# Altium project UART_Schnittstelle.PrjPcb
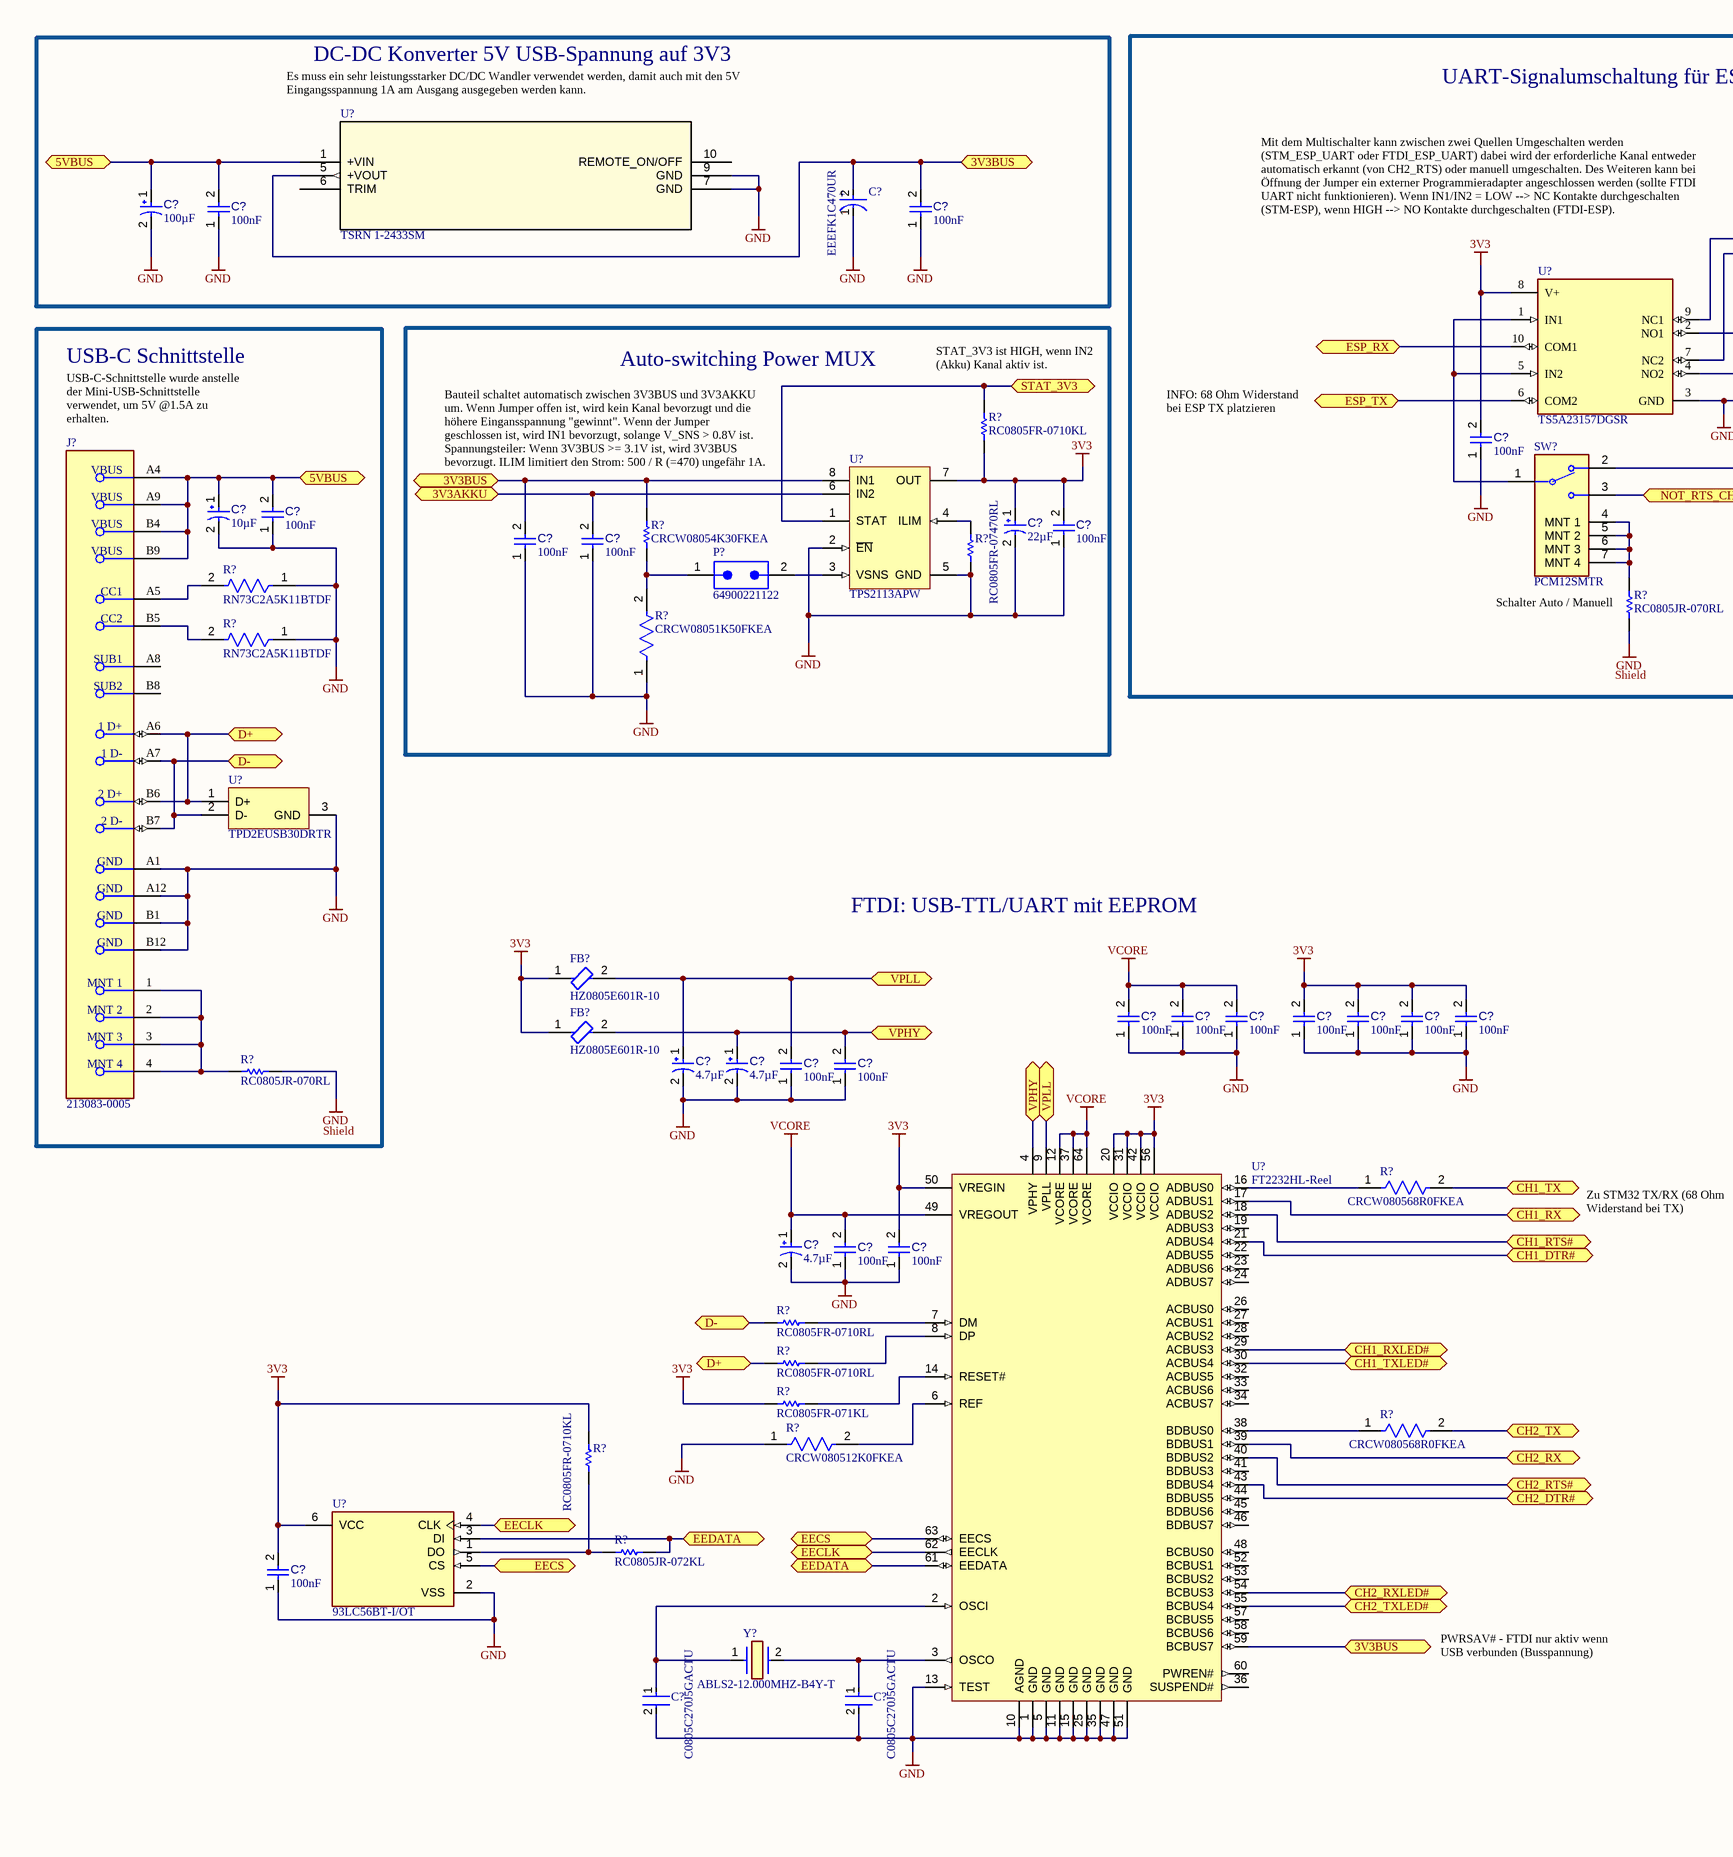
[diagram p0: PCB_USB_UART.SchDoc, left]
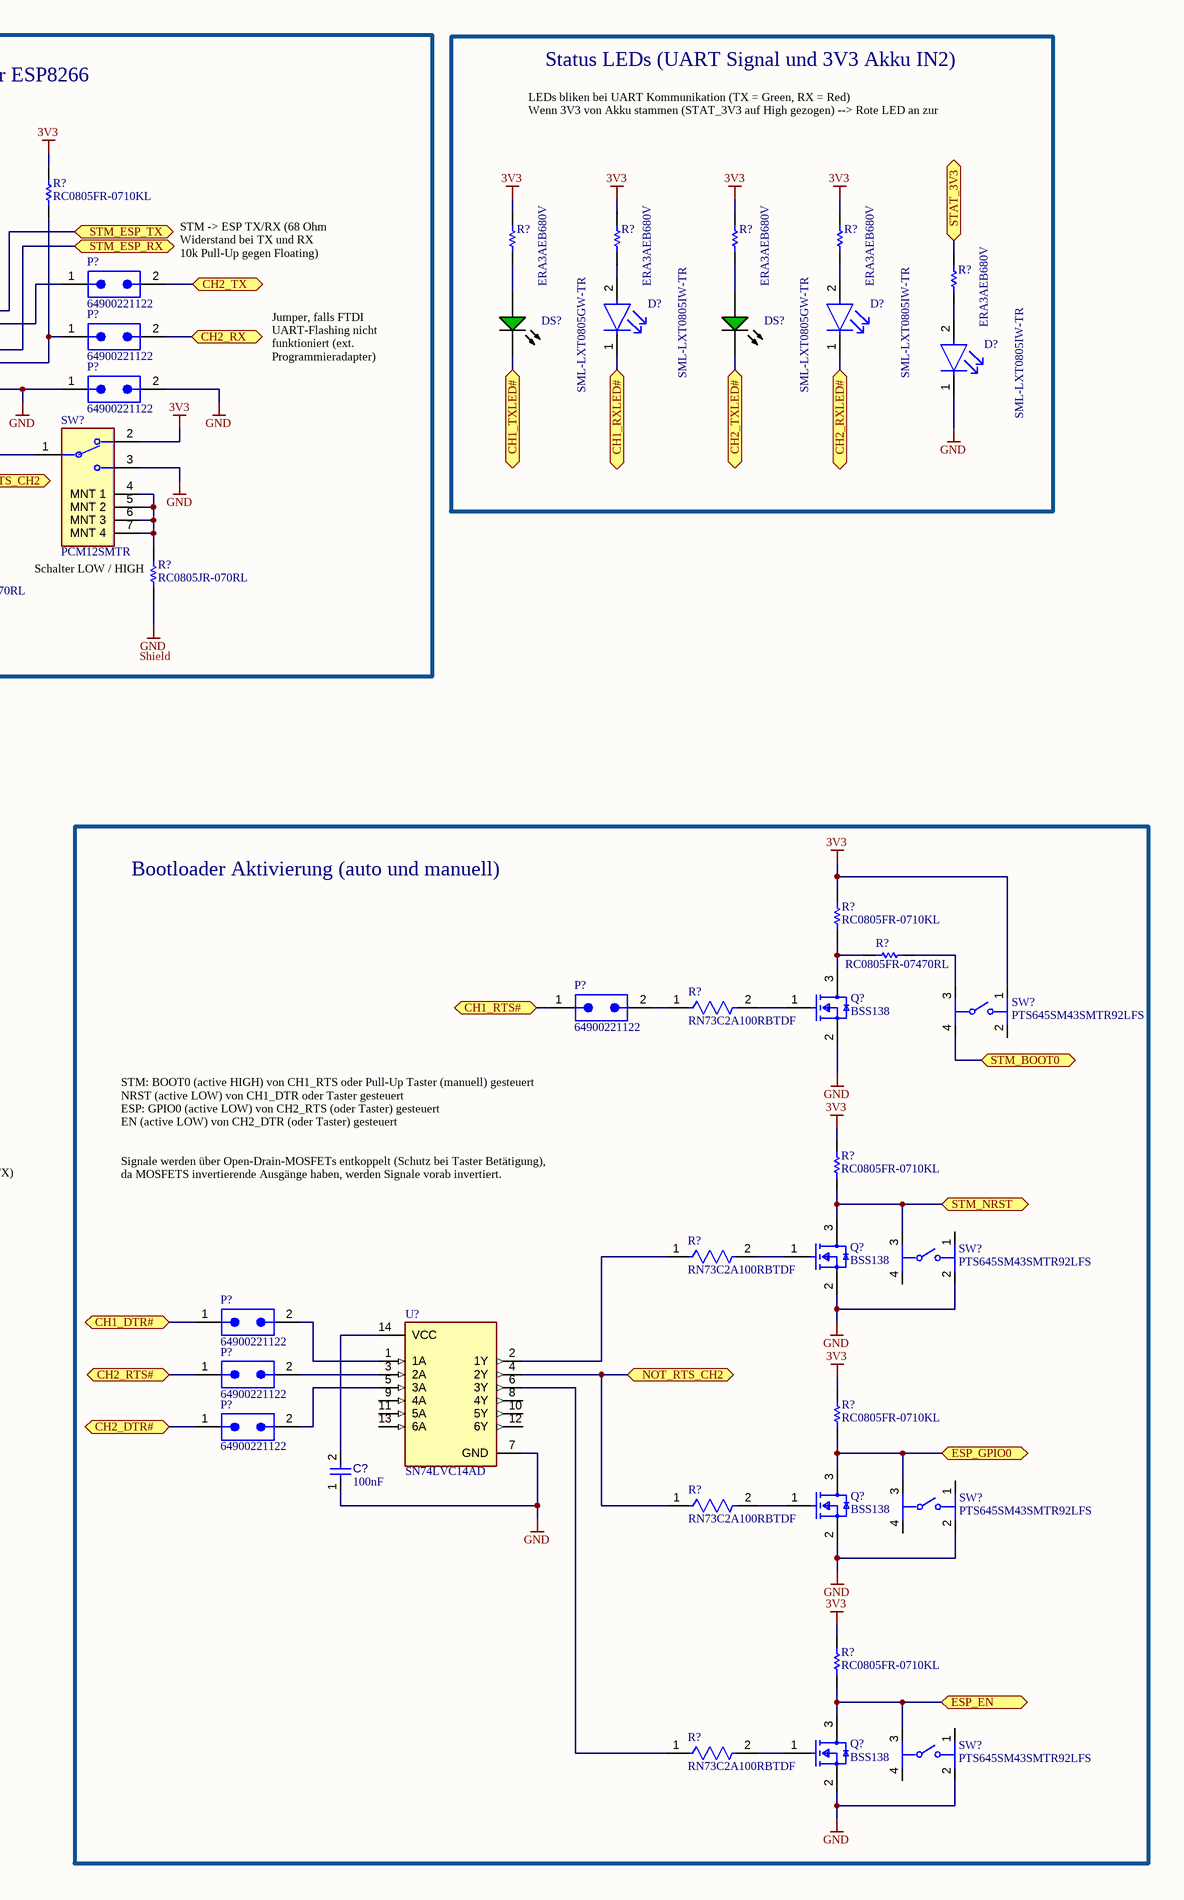
[diagram p1: PCB_USB_UART.SchDoc, right]
1 sheet, 95 parts. Net scope: flat (ports and power ports of the same name join across sheets).

## Sheet PCB_USB_UART.SchDoc
size A2; SheetNumber: 1; SheetTotal: 1

### Parts
(Parts that share a designator on the sheet are numbered #1, #2 ... from top to bottom, then left to right.)
C?#1  value 100µF  [CAPPR65-350-1150X800X1250]  (hidden comment: ECA1HM101)
C?#2  EEEFK1C470UR  [FP-FKC-MFG]
C?#3  value 100nF  [CAPC2013X95X50LL10T25]  (hidden comment: Capacitor 100 nF +/-10% 50 V 0805)
C?#4  value 100nF  [CAPC2013X95X50LL10T25]  (hidden comment: Capacitor 100 nF +/-10% 50 V 0805)
C?#5  value 100nF  [CAPC2013X95X50LL10T25]  (hidden comment: Capacitor 100 nF +/-10% 50 V 0805)
C?#6  value 10µF  [CAPPR55-200-1100X500X1200]  (hidden comment: ECA1HM100)
C?#7  value 22µF  [CAPPR55-200-1100X500X1200]  (hidden comment: ECA1HM220)
C?#8  value 100nF  [CAPC2013X95X50LL10T25]  (hidden comment: Capacitor 100 nF +/-10% 50 V 0805)
C?#9  value 100nF  [CAPC2013X95X50LL10T25]  (hidden comment: Capacitor 100 nF +/-10% 50 V 0805)
C?#10  value 100nF  [CAPC2013X95X50LL10T25]  (hidden comment: Capacitor 100 nF +/-10% 50 V 0805)
C?#11  value 100nF  [CAPC2013X95X50LL10T25]  (hidden comment: Capacitor 100 nF +/-10% 50 V 0805)
C?#12  value 100nF  [CAPC2013X95X50LL10T25]  (hidden comment: Capacitor 100 nF +/-10% 50 V 0805)
C?#13  value 100nF  [CAPC2013X95X50LL10T25]  (hidden comment: Capacitor 100 nF +/-10% 50 V 0805)
C?#14  value 100nF  [CAPC2013X95X50LL10T25]  (hidden comment: Capacitor 100 nF +/-10% 50 V 0805)
C?#15  value 100nF  [CAPC2013X95X50LL10T25]  (hidden comment: Capacitor 100 nF +/-10% 50 V 0805)
C?#16  value 100nF  [CAPC2013X95X50LL10T25]  (hidden comment: Capacitor 100 nF +/-10% 50 V 0805)
C?#17  value 100nF  [CAPC2013X95X50LL10T25]  (hidden comment: Capacitor 100 nF +/-10% 50 V 0805)
C?#18  value 100nF  [CAPC2013X95X50LL10T25]  (hidden comment: Capacitor 100 nF +/-10% 50 V 0805)
C?#19  value 4.7µF  [CAPPR55-200-1100X500X1200]  (hidden comment: ECA1HM4R7)
C?#20  value 4.7µF  [CAPPR55-200-1100X500X1200]  (hidden comment: ECA1HM4R7)
C?#21  value 100nF  [CAPC2013X95X50LL10T25]  (hidden comment: Capacitor 100 nF +/-10% 50 V 0805)
C?#22  value 100nF  [CAPC2013X95X50LL10T25]  (hidden comment: Capacitor 100 nF +/-10% 50 V 0805)
C?#23  value 4.7µF  [CAPPR55-200-1100X500X1200]  (hidden comment: ECA1HM4R7)
C?#24  value 100nF  [CAPC2013X95X50LL10T25]  (hidden comment: Capacitor 100 nF +/-10% 50 V 0805)
C?#25  value 100nF  [CAPC2013X95X50LL10T25]  (hidden comment: Capacitor 100 nF +/-10% 50 V 0805)
C?#26  value 100nF  [CAPC2013X95X50LL10T25]  (hidden comment: Capacitor 100 nF +/-10% 50 V 0805)
C?#27  value 100nF  [CAPC2013X95X50LL10T25]  (hidden comment: Capacitor 100 nF +/-10% 50 V 0805)
C?#28  C0805C270J5GACTU  [FP-C0805C-DN-MFG]
C?#29  C0805C270J5GACTU  [FP-C0805C-DN-MFG]
D?#1  SML-LXT0805IW-TR  [FP-SML-LXT0805IW-TR-MFG]
D?#2  SML-LXT0805IW-TR  [FP-SML-LXT0805IW-TR-MFG]
D?#3  SML-LXT0805IW-TR  [FP-SML-LXT0805IW-TR-MFG]
DS?#1  SML-LXT0805GW-TR  [LUMX-SML-LXT0805_V]
DS?#2  SML-LXT0805GW-TR  [LUMX-SML-LXT0805_V]
FB?#1  HZ0805E601R-10  [FP-HZ0805-MFG]
FB?#2  HZ0805E601R-10  [FP-HZ0805-MFG]
J?  213083-0005  [FP-2130830005-MFG]
P?#1  64900221122  [64900221122]
P?#2  64900221122  [64900221122]
P?#3  64900221122  [64900221122]
P?#4  64900221122  [64900221122]
P?#5  64900221122  [64900221122]
P?#6  64900221122  [64900221122]
P?#7  64900221122  [64900221122]
P?#8  64900221122  [64900221122]
Q?#1  BSS138  [FP-318-08-IPC_B]
Q?#2  BSS138  [FP-318-08-IPC_B]
Q?#3  BSS138  [FP-318-08-IPC_B]
Q?#4  BSS138  [FP-318-08-IPC_B]
R?#1  RC0805FR-0710KL  [RESC2013X60X35NL10T20]
R?#2  ERA3AEB680V  [RESC1608X55X30LL20T20]
R?#3  ERA3AEB680V  [RESC1608X55X30LL20T20]
R?#4  ERA3AEB680V  [RESC1608X55X30LL20T20]
R?#5  ERA3AEB680V  [RESC1608X55X30LL20T20]
R?#6  ERA3AEB680V  [RESC1608X55X30LL20T20]
R?#7  RC0805FR-0710KL  [RESC2013X60X35NL10T20]
R?#8  CRCW08054K30FKEA  [RESC2013X50X30LL20T20]
R?#9  RC0805FR-07470RL  [RESC2013X60X35LL10T20]
R?#10  RN73C2A5K11BTDF  [FP-RN732A-MFG]
R?#11  RC0805JR-070RL  [RESC2013X60X35ML10T20]
R?#12  RC0805JR-070RL  [RESC2013X60X35ML10T20]
R?#13  RN73C2A5K11BTDF  [FP-RN732A-MFG]
R?#14  CRCW08051K50FKEA  [FP-CRCW0805-e3-MFG]
R?#15  RC0805FR-0710KL  [RESC2013X60X35NL10T20]
R?#16  RC0805FR-07470RL  [RESC2013X60X35LL10T20]
R?#17  RN73C2A100RBTDF  [FP-RN732A-MFG]
R?#18  RC0805JR-070RL  [RESC2013X60X35ML10T20]
R?#19  CRCW080568R0FKEA  [FP-CRCW0805-e3-IPC_C]
R?#20  RC0805FR-0710KL  [RESC2013X60X35NL10T20]
R?#21  RN73C2A100RBTDF  [FP-RN732A-MFG]
R?#22  RC0805FR-0710RL  [RESC2013X60X35ML10T20]
R?#23  RC0805FR-0710RL  [RESC2013X60X35ML10T20]
R?#24  RC0805FR-071KL  [RESC2013X60X35ML10T20]
R?#25  CRCW080568R0FKEA  [FP-CRCW0805-e3-IPC_C]
R?#26  CRCW080512K0FKEA  [FP-CRCW0805-e3-IPC_A]
R?#27  RC0805FR-0710KL  [RESC2013X60X35NL10T20]
R?#28  RC0805FR-0710KL  [RESC2013X60X35NL10T20]
R?#29  RC0805JR-072KL  [RESC2013X60X35ML10T20]
R?#30  RN73C2A100RBTDF  [FP-RN732A-MFG]
R?#31  RC0805FR-0710KL  [RESC2013X60X35NL10T20]
R?#32  RN73C2A100RBTDF  [FP-RN732A-MFG]
SW?#1  PCM12SMTR  [FP-PCM12SMTR-MFG]
SW?#2  PCM12SMTR  [FP-PCM12SMTR-MFG]
SW?#3  PTS645SM43SMTR92LFS  [FP-PTS645SM43SMTR92LFS-MFG]
SW?#4  PTS645SM43SMTR92LFS  [FP-PTS645SM43SMTR92LFS-MFG]
SW?#5  PTS645SM43SMTR92LFS  [FP-PTS645SM43SMTR92LFS-MFG]
SW?#6  PTS645SM43SMTR92LFS  [FP-PTS645SM43SMTR92LFS-MFG]
U?#1  TSRN 1-2433SM  [TSR(N]
U?#2  TS5A23157DGSR  [FP-DGS0010A-IPC_C]
U?#3  TPS2113APW  [PW0008A_N]
U?#4  TPD2EUSB30DRTR  [DRT0003A]
U?#5  FT2232HL-Reel  [LQFP-64_M]
U?#6  SN74LVC14AD  [FP-D0014A-MFG]
U?#7  93LC56BT-I/OT  [FP-C04-028-MFG]
Y?  ABLS2-12.000MHZ-B4Y-T  [ABLS]

### Blocks framed on the sheet
DC-DC Konverter 5V USB-Spannung auf 3V3: C?#1-C?#4 U?#1
UART-Signalumschaltung für ESP8266: C?#5 P?#1-P?#3 R?#1 R?#11 R?#12 SW?#1 SW?#2 U?#2
Status LEDs (UART Signal und 3V3 Akku IN2): D?#1-D?#3 DS?#1 DS?#2 R?#2-R?#6
USB-C Schnittstelle: C?#6 C?#8 J? R?#10 R?#13 R?#18 U?#4
Auto-switching Power MUX: C?#7 C?#9-C?#11 P?#4 R?#7-R?#9 R?#14 U?#3
Bootloader Aktivierung (auto und manuell): C?#26 P?#5-P?#8 Q?#1-Q?#4 R?#15-R?#17 R?#20 R?#21 R?#28 R?#30-R?#32 SW?#3-SW?#6 U?#6

### Ports
3V3AKKU (bidir), 3V3BUS (bidir, see PCB_USB_UART[2B], PCB_USB_UART[3A]), 3V3BUS (bidir, see PCB_USB_UART[2B], PCB_USB_UART[4D]), 3V3BUS (bidir, see PCB_USB_UART[3A], PCB_USB_UART[4D]), 5VBUS (bidir, see PCB_USB_UART[1A]), 5VBUS (bidir, see PCB_USB_UART[1B]), CH1_DTR# (bidir, see PCB_USB_UART[5C]), CH1_RTS# (bidir, see PCB_USB_UART[5C]), CH1_RTS# (bidir, see PCB_USB_UART[6C]), CH1_RX (bidir), CH1_RXLED# (bidir, see PCB_USB_UART[4C]), CH1_RXLED# (bidir, see PCB_USB_UART[7B]), CH1_TX (bidir), CH1_TXLED# (bidir, see PCB_USB_UART[4C]), CH1_TXLED# (bidir, see PCB_USB_UART[6B]), CH2_DTR# (bidir, see PCB_USB_UART[5C]), CH2_RTS# (bidir, see PCB_USB_UART[5C]), CH2_RX (bidir, see PCB_USB_UART[5C]), CH2_RX (bidir, see PCB_USB_UART[6A]), CH2_RXLED# (bidir, see PCB_USB_UART[4D]), CH2_RXLED# (bidir, see PCB_USB_UART[7B]), CH2_TX (bidir, see PCB_USB_UART[5C]), CH2_TX (bidir, see PCB_USB_UART[6A]), CH2_TXLED# (bidir, see PCB_USB_UART[4D]), CH2_TXLED# (bidir, see PCB_USB_UART[7B]), D+ (bidir, see PCB_USB_UART[1B]), D+ (bidir, see PCB_USB_UART[2C]), D- (bidir, see PCB_USB_UART[1B]), D- (bidir, see PCB_USB_UART[2C]), EECLK (bidir, see PCB_USB_UART[2D]), EECLK (bidir, see PCB_USB_UART[3D]), EECS (bidir, see PCB_USB_UART[2D]), EECS (bidir, see PCB_USB_UART[3D]), EEDATA (bidir, see PCB_USB_UART[2D]), EEDATA (bidir, see PCB_USB_UART[3D]), ESP_EN (bidir), ESP_GPIO0 (bidir), ESP_RX (bidir), ESP_TX (bidir), NOT_RTS_CH2 (bidir, see PCB_USB_UART[5B]), NOT_RTS_CH2 (bidir, see PCB_USB_UART[7C]), STAT_3V3 (bidir, see PCB_USB_UART[3A]), STAT_3V3 (bidir, see PCB_USB_UART[8A]), STM_BOOT0 (bidir), STM_ESP_RX (bidir), STM_ESP_TX (bidir), STM_NRST (bidir), VPHY (bidir, see PCB_USB_UART[3C]), VPLL (bidir, see PCB_USB_UART[3B]), VPLL (bidir, see PCB_USB_UART[3C])

### Nets
3V3: C?#5.2 C?#7.1 C?#9.2 C?#15.2 C?#16.2 C?#17.2 C?#18.2 C?#25.2 C?#27.2 FB?#1.1 FB?#2.1 R?#1.2 R?#2.2 R?#3.2 R?#4.2 R?#5.2 R?#7.1 R?#15.2 R?#20.2 R?#24.1 R?#27.2 R?#28.2 R?#31.2 SW?#1.2 SW?#3.1 U?#2.8(V+) U?#3.7(OUT) U?#5.20(VCCIO) U?#5.31(VCCIO) U?#5.42(VCCIO) U?#5.50(VREGIN) U?#5.56(VCCIO) U?#7.6(VCC)
GND: C?#1.2 C?#2.1(C) C?#3.1 C?#4.1 C?#5.1 C?#6.2 C?#7.2 C?#8.1 C?#9.1 C?#10.1 C?#11.1 C?#12.1 C?#13.1 C?#14.1 C?#15.1 C?#16.1 C?#17.1 C?#18.1 C?#19.2 C?#20.2 C?#21.1 C?#22.1 C?#23.2 C?#24.1 C?#25.1 C?#26.1 C?#27.1 C?#28.2 C?#29.2 D?#3.1(C) J?.A1(GND) J?.A12(GND) J?.B1(GND) J?.B12(GND) P?#3.1 P?#3.2 Q?#1.2(S) Q?#2.2(S) Q?#3.2(S) Q?#4.2(S) R?#9.1 R?#10.1 R?#11.1 R?#12.1 R?#13.1 R?#14.1 R?#18.2 R?#26.1 SW?#1.3 SW?#4.2 SW?#5.2 SW?#6.2 U?#1.7(GND) U?#1.9(GND) U?#2.3(GND) U?#3.2(~{EN}) U?#3.5(GND) U?#4.3(GND) U?#5.1(GND) U?#5.5(GND) U?#5.10(AGND) U?#5.11(GND) U?#5.13(TEST) U?#5.15(GND) U?#5.25(GND) U?#5.35(GND) U?#5.47(GND) U?#5.51(GND) U?#6.7(GND) U?#7.2(VSS)
VCORE: C?#12.2 C?#13.2 C?#14.2 C?#23.1 C?#24.2 U?#5.12(VCORE) U?#5.37(VCORE) U?#5.49(VREGOUT) U?#5.64(VCORE)
NetC?#1_1: C?#1.1 C?#3.2 C?#6.1 C?#8.2 J?.A4(VBUS) J?.A9(VBUS) J?.B4(VBUS) J?.B9(VBUS) U?#1.1(+VIN) ; port 5VBUS
NetC?#2_2: C?#2.2(A) C?#4.2 C?#10.2 R?#8.2 U?#1.5(+VOUT) U?#3.8(IN1) U?#5.59(BCBUS7) ; port 3V3BUS
NetC?#11_2: C?#11.2 U?#3.6(IN2) ; port 3V3AKKU
NetC?#19_1: C?#19.1 C?#21.2 FB?#1.2 U?#5.9(VPLL) ; port VPLL
NetC?#20_1: C?#20.1 C?#22.2 FB?#2.2 U?#5.4(VPHY) ; port VPHY
NetC?#26_2: C?#26.2 U?#6.14(VCC)
NetC?#28_1: C?#28.1 U?#5.2(OSCI) Y?.1
NetC?#29_1: C?#29.1 U?#5.3(OSCO) Y?.2
NetD?#1_1: D?#1.1(C) U?#5.29(ACBUS3) ; port CH1_RXLED#
NetD?#1_2: D?#1.2(A) R?#3.1
NetD?#2_1: D?#2.1(C) U?#5.54(BCBUS3) ; port CH2_RXLED#
NetD?#2_2: D?#2.2(A) R?#5.1
NetD?#3_2: D?#3.2(A) R?#6.1
NetDS?#1_1: DS?#1.1(A) R?#2.1
NetDS?#1_2: DS?#1.2(K) U?#5.30(ACBUS4) ; port CH1_TXLED#
NetDS?#2_1: DS?#2.1(A) R?#4.1
NetDS?#2_2: DS?#2.2(K) U?#5.55(BCBUS4) ; port CH2_TXLED#
NetJ?_1: J?.1(MNT_1) J?.2(MNT_2) J?.3(MNT_3) J?.4(MNT_4) R?#18.1
NetJ?_A5: J?.A5(CC1) R?#10.2
NetJ?_A6: J?.A6(1_D+) J?.B6(2_D+) R?#23.1 U?#4.1(D+) ; port D+
NetJ?_A7: J?.A7(1_D-) J?.B7(2_D-) R?#22.1 U?#4.2(D-) ; port D-
NetJ?_B5: J?.B5(CC2) R?#13.2
NetP?#1_1: P?#1.1 U?#2.2(NO1)
NetP?#1_2: P?#1.2 R?#25.2 ; port CH2_TX
NetP?#2_1: P?#2.1 R?#1.1 U?#2.4(NO2)
NetP?#2_2: P?#2.2 U?#5.39(BDBUS1) ; port CH2_RX
NetP?#4_1: P?#4.1 R?#8.1 R?#14.2
NetP?#4_2: P?#4.2 U?#3.3(VSNS)
NetP?#5_1: P?#5.1 U?#5.18(ADBUS2) ; port CH1_RTS#
NetP?#5_2: P?#5.2 R?#17.1
NetP?#6_1: P?#6.1 U?#5.21(ADBUS4) ; port CH1_DTR#
NetP?#6_2: P?#6.2 U?#6.1(1A)
NetP?#7_1: P?#7.1 U?#5.40(BDBUS2) ; port CH2_RTS#
NetP?#7_2: P?#7.2 U?#6.3(2A)
NetP?#8_1: P?#8.1 U?#5.43(BDBUS4) ; port CH2_DTR#
NetP?#8_2: P?#8.2 U?#6.5(3A)
NetQ?#1_1: Q?#1.1(G) R?#17.2
NetQ?#1_3: Q?#1.3(D) R?#15.1 R?#16.1
NetQ?#2_1: Q?#2.1(G) R?#21.2
NetQ?#2_3: Q?#2.3(D) R?#20.1 SW?#4.3 ; port STM_NRST
NetQ?#3_1: Q?#3.1(G) R?#30.2
NetQ?#3_3: Q?#3.3(D) R?#28.1 SW?#5.3 ; port ESP_GPIO0
NetQ?#4_1: Q?#4.1(G) R?#32.2
NetQ?#4_3: Q?#4.3(D) R?#31.1 SW?#6.3 ; port ESP_EN
NetR?#6_2: R?#6.2 R?#7.2 U?#3.1(STAT) ; port STAT_3V3
NetR?#9_2: R?#9.2 U?#3.4(ILIM)
NetR?#11_2: R?#11.2 SW?#1.4(MNT_1) SW?#1.5(MNT_2) SW?#1.6(MNT_3) SW?#1.7(MNT_4)
NetR?#12_2: R?#12.2 SW?#2.4(MNT_1) SW?#2.5(MNT_2) SW?#2.6(MNT_3) SW?#2.7(MNT_4)
NetR?#16_2: R?#16.2 SW?#3.3
NetR?#19_1: R?#19.1 U?#5.16(ADBUS0)
NetR?#19_2: R?#19.2 ; port CH1_TX
NetR?#21_1: R?#21.1 U?#6.2(1Y)
NetR?#22_2: R?#22.2 U?#5.7(DM)
NetR?#23_2: R?#23.2 U?#5.8(DP)
NetR?#24_2: R?#24.2 U?#5.14(RESET#)
NetR?#25_1: R?#25.1 U?#5.38(BDBUS0)
NetR?#26_2: R?#26.2 U?#5.6(REF)
NetR?#27_1: R?#27.1 R?#29.1 U?#7.1(DO)
NetR?#29_2: R?#29.2 U?#5.61(EEDATA) U?#7.3(DI) ; port EEDATA
NetR?#30_1: R?#30.1 SW?#2.3 U?#6.4(2Y) ; port NOT_RTS_CH2
NetR?#32_1: R?#32.1 U?#6.6(3Y)
NetSW?#1_1: SW?#1.1 SW?#2.2
NetSW?#2_1: SW?#2.1 U?#2.1(IN1) U?#2.5(IN2)
NetSW?#3_4: SW?#3.4 ; port STM_BOOT0
NetU?#2_6: U?#2.6(COM2) ; port ESP_TX
NetU?#2_7: U?#2.7(NC2) ; port STM_ESP_RX
NetU?#2_9: U?#2.9(NC1) ; port STM_ESP_TX
NetU?#2_10: U?#2.10(COM1) ; port ESP_RX
NetU?#5_17: U?#5.17(ADBUS1) ; port CH1_RX
NetU?#5_62: U?#5.62(EECLK) U?#7.4(CLK) ; port EECLK
NetU?#5_63: U?#5.63(EECS) U?#7.5(CS) ; port EECS

Not connected (* = marked no-connect by the designer): J? A8(SUB1) B8(SUB2); SW?#3 2; SW?#4 1 4; SW?#5 1 4; SW?#6 1 4; U?#1 6(TRIM) 10(REMOTE_ON/OFF); U?#5 19(ADBUS3) 22(ADBUS5) 23(ADBUS6) 24(ADBUS7) 26(ACBUS0) 27(ACBUS1) 28(ACBUS2) 32(ACBUS5) 33(ACBUS6) 34(ACBUS7) 36(SUSPEND#) 41(BDBUS3) 44(BDBUS5) 45(BDBUS6) 46(BDBUS7) 48(BCBUS0) 52(BCBUS1) 53(BCBUS2) 57(BCBUS5) 58(BCBUS6) 60(PWREN#); U?#6 8(4Y) 9(4A) 10(5Y) 11(5A) 12(6Y) 13(6A)

### Notes on the sheet
- Es muss ein sehr leistungsstarker DC/DC Wandler verwendet werden, damit auch mit den 5V Eingangsspannung 1A am Ausgang ausgegeben werden kann.
- LEDs bliken bei UART Kommunikation (TX = Green, RX = Red)
  Wenn 3V3 von Akku stammen (STAT_3V3 auf High gezogen) --> Rote LED an zur Statusanzeige
- (near R?#1) Mit dem Multischalter kann zwischen zwei Quellen Umgeschalten werden (STM_ESP_UART oder FTDI_ESP_UART) dabei wird der erforderliche Kanal entweder automatisch erkannt (von CH2_RTS) oder manuell umgeschalten. Des Weiteren kann bei Öffnung der Jumper ein externer Programmieradapter angeschlossen werden (sollte FTDI UART nicht funktionieren). Wenn IN1/IN2 = LOW --> NC Kontakte durchgeschalten (STM-ESP), wenn HIGH --> NO Kontakte durchgeschalten (FTDI-ESP).
- (near P?#1) STM -> ESP TX/RX (68 Ohm Widerstand bei TX und RX 10k Pull-Up gegen Floating)
- (near R?#7) STAT_3V3 ist HIGH, wenn IN2 (Akku) Kanal aktiv ist.
- Jumper, falls FTDI UART-Flashing nicht funktioniert (ext. Programmieradapter)
- USB-C-Schnittstelle wurde anstelle der Mini-USB-Schnittstelle verwendet, um 5V @1.5A zu erhalten.
- INFO: 68 Ohm Widerstand bei ESP TX platzieren
- Bauteil schaltet automatisch zwischen 3V3BUS und 3V3AKKU um. Wenn Jumper offen ist, wird kein Kanal bevorzugt und die höhere Eingansspannung "gewinnt". Wenn der Jumper geschlossen ist, wird IN1 bevorzugt, solange V_SNS > 0.8V ist. Spannungsteiler: Wenn 3V3BUS >= 3.1V ist, wird 3V3BUS bevorzugt. ILIM limitiert den Strom: 500 / R (=470) ungefähr 1A.
- (near R?#11) Schalter LOW / HIGH
- (near R?#12) Schalter Auto / Manuell
- (near R?#12) Shield
- Shield
- FTDI: USB-TTL/UART mit EEPROM
- Zu STM32 TX/RX (68 Ohm Widerstand bei TX)
- STM: BOOT0 (active HIGH) von CH1_RTS oder Pull-Up Taster (manuell) gesteuert
  NRST (active LOW) von CH1_DTR oder Taster gesteuert
  ESP: GPIO0 (active LOW) von CH2_RTS (oder Taster) gesteuert
  EN (active LOW) von CH2_DTR (oder Taster) gesteuert
  Signale werden über Open-Drain-MOSFETs entkoppelt (Schutz bei Taster Betätigung), da MOSFETS invertierende Ausgänge haben, werden Signale vorab invertiert.
- PWRSAV# - FTDI nur aktiv wenn USB verbunden (Busspannung)
- DWG NO:
- REV:
- THIS DOCUMENT AND THE DATA DISCLOSED HEREIN OR
- HEREWITH IS THE PROPERTY OF ALTIUM LIMITED AND MAY
- BE FREELY DISTRIBUTED IN WHOLE. NO RIGHTS ARE
- RESERVED OR EXPRESS OR IMPLIED WARANTEE GIVEN.
- REVISION
- DESCRIPTION
- DATE
- APPROVED
- ENG:
- APPROVALS
- PROJECT
- DSN:
- CHK:
- REFERENCE DOCUMENTS
- PROJECT REVISION:
- TITLE
- DOCUMENT REVISION:
- DESIGN ITEM:
- BOM:
- FAB DWG:
- PCB DWG:
- ASSY DWG:
- SCALE:
- A2
- SIZE
- CAGE CODE
- FILE NAME
- DWG NO.
- SHEET
- OF
- REV
- (in symbol CMP-05427-002132-1) +

### Library data of the parts
C?#1 = CMP-001-00026-7: Aluminum Electrolytic Capacitor, 100 uF, +/- 20%, 50 V, -40 to 85 degC, 2-Pin THD, RoHS, Bulk; Manufacturer: Panasonic; Voltage Rating: 50V; Ripple Current: 250mA; Datasheet URL: https://industrial.panasonic.com/cdbs/www-data/pdf/RDF0000/ABA0000C1218.pdf; Lead Pitch: 3.5mm; Mounting Technology: TH; Package Description: 2-Pin Radial Lead, Dia 8 mm, Height 12.5 mm; Diameter: 8mm; Ripple Current (AC): 250mA; Manufacturer URL: http://www.panasonic.com/; Capacitor Type: Electrolytic; Max Operating Temperature: 85°C; Pins: 2; Min Operating Temperature: -40°C; Tolerance: 20%; Case/Package: Radial; Packaging: Bulk; Package Quantity: 200; Package Reference: CAPPR65-350-1150X800X1250; RoHS Compliant: True; Datasheet Version: Rev. 05, 10/2016
C?#2 = CMP-05427-002132-1: CAP ALUM 47UF 20% 16V SMD; Dielectric Material: Aluminium; ESR (Equivalent Series Resistance): 700mR; Ripple Current: 160mA; Life (Hours): 2000Hour; Leakage Current: 3uA; Voltage: 10V; Length: 5.8mm; Voltage Rating: 16V; Ratings: AEC-Q200; Package Quantity: 1000; Min Operating Temperature: -55°C; Mount: Surface Mount; Width: 6.5mm; Voltage Rating (DC): 16V; Radiation Hardening: No; Diameter: 5mm; RoHS Compliant: Yes; Reach SVHC Compliant: Yes; Termination: SMD/SMT; Material: Aluminium; Ripple Current (AC): 160mA; Impedance: 700mR; Series: FK; Height - Seated (Max): 0.228inch; Packaging: Tape and Reel; Height: 5.8mm; Capacitance: 47uF; Contact Plating: Tin; Construction: Cylindrical; Number of Pins: 2; Lead Free: Lead Free; Tolerance: 20%; Max Operating Temperature: 105°C; Case/Package: Radial
C?#3-C?#5 C?#8-C?#18 C?#21 C?#22 C?#24-C?#27 = CMP-001-00018-6: Chip Capacitor, 100 nF, +/- 10%, 50 V, 0805 (2012 Metric); Capacitor Type: Ceramic; Voltage Rating: 50V; Pins: 2; Max Operating Temperature: 125°C; Min Operating Temperature: -55°C; Mounting Technology: SM; Case/Package: 0805; RoHS Compliant: True; Tolerance: 10%
C?#6 = CMP-001-00025-7: Aluminum Electrolytic Capacitor, 10 uF, +/- 20%, 50 V, -40 to 85 degC, 2-Pin THD, RoHS, Bulk; Manufacturer: Panasonic; Ripple Current (AC): 65mA; Voltage Rating: 50V; Mounting Technology: TH; RoHS Compliant: True; Capacitor Type: Electrolytic; Datasheet Version: Rev. 05, 10/2016; Min Operating Temperature: -40°C; Packaging: Bulk; Ripple Current: 65mA; Tolerance: 20%; Max Operating Temperature: 85°C; Datasheet URL: https://industrial.panasonic.com/cdbs/www-data/pdf/RDF0000/ABA0000C1218.pdf; Lead Pitch: 2mm; Pins: 2; Diameter: 5mm; Manufacturer URL: http://www.panasonic.com/; Package Reference: CAPPR55-200-1100X500X1200; Package Description: 2-Pin Radial Lead, Dia 5 mm, Height 12 mm; Case/Package: Radial; Package Quantity: 200
C?#7 = CMP-001-00027-7: Aluminum Electrolytic Capacitor, 22 uF, +/- 20%, 50 V, -40 to 85 degC, 2-Pin THD, RoHS, Bulk; Manufacturer: Panasonic; Ripple Current (AC): 100mA; Voltage Rating: 50V; Pins: 2; Case/Package: Radial; Datasheet Version: Rev. 05, 10/2016; RoHS Compliant: True; Max Operating Temperature: 85°C; Ripple Current: 100mA; Capacitor Type: Electrolytic; Mounting Technology: TH; Package Quantity: 200; Package Reference: CAPPR55-200-1100X500X1200; Package Description: 2-Pin Radial Lead, Dia 5 mm, Height 12 mm; Packaging: Bulk; Lead Pitch: 2mm; Min Operating Temperature: -40°C; Diameter: 5mm; Tolerance: 20%; Datasheet URL: https://industrial.panasonic.com/cdbs/www-data/pdf/RDF0000/ABA0000C1218.pdf; Manufacturer URL: http://www.panasonic.com/
C?#19 C?#20 C?#23 = CMP-001-00033-7: Aluminum Electrolytic Capacitor, 4.7 uF, +/- 20%, 50 V, -40 to 85 degC, 2-Pin THD, RoHS, Bulk; Manufacturer: Panasonic; Ripple Current (AC): 45mA; Voltage Rating: 50V; Diameter: 5mm; Min Operating Temperature: -40°C; Lead Pitch: 2mm; Package Quantity: 200; Capacitor Type: Electrolytic; Ripple Current: 45mA; Datasheet Version: Rev. 05, 10/2016; Case/Package: Radial; Pins: 2; Manufacturer URL: http://www.panasonic.com/; RoHS Compliant: True; Package Description: 2-Pin Radial Lead, Dia 5 mm, Height 12 mm; Packaging: Bulk; Datasheet URL: https://industrial.panasonic.com/cdbs/www-data/pdf/RDF0000/ABA0000C1218.pdf; Mounting Technology: TH; Max Operating Temperature: 85°C; Package Reference: CAPPR55-200-1100X500X1200; Tolerance: 20%
C?#28 C?#29 = CMP-2007-00597-2: CAP CER 27PF 50V C0G/NP0 0805; Manufacturer: KEMET; Temperature Coefficient: 30ppm/°C; Tolerance: 0.05; Temperature Characteristic: C0G; Material: Ceramic; Device Class L3: Ceramic Capacitors; Voltage Rating: 50 V; Package: C0805C-DN; Height: 0.88mm; Temperature: -55°C to +125°C; Category: Cap; ComponentLink2URL: https://content.kemet.com/datasheets/KEM_C1003_C0G_SMD.pdf; Octopart: https://octopart.com/c0805c270j5gactu-kemet-91046; Mouser Description: Cap Ceramic 27pF 50V C0G 5% SMD 0805 125C Plastic T/R; Temperature Range High: +125°C; RoHS: TRUE; Lead Free: Yes; ComponentLink2Description: Datasheet; Temperature Range Low: -55°C; Digikey Description: CAP CER 27PF 50V C0G/NP0 0805; Manufacturer Part Number: C0805C270J5GACTU; Ipc Land Pattern Name: CAPC200125X78; Automotive: No; Device Class L1: Passive Components; Value: 27 pF; Device Class L2: Capacitors; Capacitance: 27 pF
D?#1-D?#3 = CMP-1724-00002-2: LED RED DIFFUSED SMD; Lens Style: Rectangular; Luminous Intensity: 11mcd; Approvals: UL; Test Current: 20mA; Forward Voltage: 2V; Number of LEDs: 1; Wavelength: 635nm; Lens Color: White; Viewing Angle: 140°; Min Operating Temperature: -25°C; Case Code (Metric): 2012; Mount: Surface Mount; Case Code (Imperial): 0805; Height: 0.8mm; Lead Free: Lead Free; Color: Red; Package Quantity: 1; Illumination Color: Red; Lens Transparency: Diffused; Forward Current: 20mA; Packaging: Tape and Reel; Length: 2mm; Case/Package: 0805; REACH SVHC: No SVHC; Width: 1.25mm; Number of Pins: 2; Max Operating Temperature: 80°C; Dominant Wavelength: 635nm
DS?#1 DS?#2 = CMP-1724-00001-1: LED, GREEN, 565 nm, 2 V, -25 to 80 degC, 2-Pin SMD, RoHS, Tape and Reel; Case\/Package: 0805; RoHSCompliant: true; REACH SVHC: No SVHC; Packaging: Tape and Reel; ComponentLink2URL: http://www.lumex.com/content/files/ProductAttachment/SML-LXT0805GW-TR.pdf; ComponentLink1URL: http://www.lumexinstruments.com/; Min Operating Temperature: -25 degC; Max Operating Temperature: 85 degC; DatasheetVersion: Rev. F, 09/2009; Case Code (Metric): 2012; Width: 1.25 mm; PackageDescription: 2-Pin Surface Mount Device, Body 2 x 1.25 mm; ComponentLink1Description: Manufacturer URL; Mount: Surface Mount; PackageReference: SML-LXT0805; Length: 2 mm; Case Code (Imperial): 0805; ComponentLink2Description: Datasheet; Package Quantity: 4000; Mounting Technology: Surface Mount
FB?#1 FB?#2 = CMP-2000-05194-2: FERRITE BEAD 600 OHM 0805 1LN; Current Rating: 500mA; Frequency: 100MHz; DC Resistance (DCR): 300mR; Number of Lines: 1; Impedance: 600R; Packaging: Tape and Reel; Mount: Surface Mount; Package Quantity: 1; Material: Ferrite; Width: 0.049inch; Min Operating Temperature: -40°C; Core Material: Ferrite; Max Current Rating: 500mA; Case Code (Metric): 2012; Depth: 1.45mm; Case Code (Imperial): 0805; Termination: SMD/SMT; Contact Plating: Tin; Lead Free: Lead Free; Weight: 0.00392oz; Case/Package: 0805; Test Frequency: 100MHz; Length: 2mm; Height: 1.25mm; Max Operating Temperature: 125°C; Max DC Current: 500mA
J? = CMP-04767-000030-2: CONN RCP USB2.0 TYP C 24P SMD RA; NexarPartId: 114105384; Current Rating: 5A; Number of Contacts: 16; Voltage Rating: 30V; Gender: Receptacle; Min Operating Temperature: -40°C; USB Standard: USB 2.0; Max Operating Temperature: 85°C; Contact Material: Gold, Nickel; Schedule B: 8536695050, 8536695050; Country of Origin: CN
P?#1-P?#8 = CMP-1502-00493-2: NexarPartId: 8917578; Contact Resistance: 10mΩ; Operating Supply Voltage: 600V; Current Rating: 9A; Gender: Male; Number of Contacts: 2; Lead Length: 3.5mm; Connector Type: Male Pin, Socket; Pitch: 4.2mm; Row Spacing: 5.5118mm; Insulation Resistance: 1GΩ; Height: 12.8mm; Max Operating Temperature: 105°C; Color: White; Number of Rows: 2; Voltage Rating: 600V; Termination: Solder; Fastening Type: Ramp; Width: 5.5mm; Min Operating Temperature: -40°C; Length: 5.4mm; Mount: Through Hole; Flammability Rating: UL94 V-0; Contact Gender: Male; Contact Material: Copper; Lead Pitch: 4.2mm; Housing Material: Nylon; Contact Plating: Tin; Number of Pins: 2; RoHS: Compliant; Orientation: Vertical; REACH SVHC: Unknown; Number of Positions: 2
Q?#1-Q?#4 = CMP-07173-000101-1: MOSFET N-CH 50V 220MA SOT-23; Turn-Off Delay Time: 20ns; Element Configuration: Single; Rds On Max: 3.5R; Gate to Source Voltage (Vgs): 20V; Threshold Voltage: 1.3V; Number of Elements: 1; Power Dissipation: 360mW; Rise Time: 9ns; Turn-On Delay Time: 2.5ns; Input Capacitance: 27pF; On-State Resistance: 6R; Lead Free: Lead Free; Length: 2.92mm; Width: 1.3mm; Drain to Source Breakdown Voltage: 50V; Min Operating Temperature: -55°C; REACH SVHC: No SVHC; Packaging: Tape and Reel; Radiation Hardening: No; Height: 0.93mm; Drain to Source Voltage (Vdss): 50V; Current Rating: 220mA; Voltage Rating (DC): 50V; Weight: 0.03g; Continuous Drain Current (ID): 220mA; Number of Pins: 3; Nominal Vgs: 1.3V; Max Power Dissipation: 360mW; Fall Time: 9ns; Drain to Source Resistance: 3.5R; Contact Plating: Tin; Case/Package: SOT-23; Package Quantity: 1; Dual Supply Voltage: 50V; Mount: Surface Mount; Termination: SMD/SMT; Max Operating Temperature: 150°C
R?#1 R?#7 R?#15 R?#20 R?#27 R?#28 R?#31 = CMP-1659-00013-4: Chip Resistor, 10 KOhm, +/- 1%, 0.125 W, -55 to 155 degC, 0805 (2012 Metric), RoHS, Tape and Reel; Manufacturer: Yageo; Voltage Rating: 150 V; Mount: Surface Mount; ComponentLink1Description: Manufacturer URL; ComponentLink2URL: http://www.yageo.com/documents/recent/PYu-RC_Group_51_RoHS_L_04.pdf; Pins: 2; Length: 2 mm; Min Operating Temperature: -55 degC; Height: 0.5 mm; Mounting Technology: Surface Mount; RoHSCompliant: true; REACH SVHC: No SVHC; ComponentLink1URL: http://www.yageo.com/; Max Operating Temperature: 155 degC; PackageReference: 0805; DatasheetVersion: Rev. 4, 02/2016; Package Quantity: 5000; Packaging: Tape and Reel; ComponentLink2Description: Datasheet; PackageDescription: 2-Pin Surface Mounted Device, Body 2 x 1.25 mm
R?#2-R?#6 = CMP-2000-00110-1: Manufacturer: Panasonic; Part Number: ERA3AEB680V
R?#8 = CMP-2001-03961-1: Manufacturer: Vishay Dale; Part Number: CRCW08054K30FKEA
R?#9 R?#16 = CMP-2000-06961-1: Chip Resistor, 470 Ohm, +/- 1%, 125 mW, -55 to 155 degC, 0805 (2012 Metric), RoHS, Tape and Reel; Manufacturer: Yageo; Power Rating: 250mW; Resistor Case Style: 0805[2012Metric]; Voltage Rating: 150V; Resistor Element Type: ThickFilm; Temperature Coefficient: ±100ppm/°C; Resistance: 470ohm; SVHC: ToBeAdvised; Datasheet Version: Rev. 7, 05/2017; Automotive Qualification Standard: -; Mounting Technology: SurfaceMount; Product Range: -; Packaging: Tape&Reel; Package Description: 2-Pin Surface Mounted Device, Body 2 x 1.25 mm; MSL: MSL1-Unlimited; Package Reference: 0805; Resistance Tolerance: ±1%; Datasheet URL: http://www.yageo.com/documents/recent/PYu-RC_Group_51_RoHS_L_7.pdf; Manufacturer URL: http://www.yageo.com/
R?#10 R?#13 = CMP-03211-010210-1: SMD Chip Resistor, Thin Film, 5.11KΩ, 100 V, 0805 [2012 Metric], 100 mW, 0.1%, RN73 Series; Manufacturer: TE Connectivity; Voltage Rating: 100V; Temperature Coefficient: 10ppm/°C; Power Rating: 0.1W; Device Class L1: Passive Components; Lead Free: Yes; Device Class L2: Resistors; Series: RN73; ComponentLink2Description: Datasheet; octopart_url: https://octopart.com/rn73c2a5k11btdf-te+connectivity-41219646; Package: RN732A; Category: Res; Value: 5.11KΩ; packaging: 1000 Reel; Resistance: 5.11KΩ; Manufacturer Part Number: RN73C2A5K11BTDF; Composition: Thin Film; Ipc Land Pattern Name: RESC200125X55; Octopart: https://octopart.com/rn73c2a5k11btdf-te+connectivity-41219646; RoHS: TRUE; Temperature: -55°C to 155°C; Height: 0.65mm; Automotive: No; Tolerance: 0.1%; ComponentLink2URL: https://www.te.com/commerce/DocumentDelivery/DDEController?Action=showdoc&DocId=Data+Sheet%7F1773270%7FP%7Fpdf%7FEnglish%7FENG_DS_1773270_P.pdf%7F1676162-2; Temperature Range High: 155°C; Temperature Range Low: -55°C; Device Class L3: Chip SMD Resistors
R?#11 R?#12 R?#18 = CMP-2100-03673-1: Chip Resistor, 0 Ohm, Jumper, +/- 5%, 0.125 W, -55 to 155 degC, 0805 (2012 Metric), RoHS, Tape and Reel; Manufacturer: Yageo; Power Rating: 125mW; Resistance: 0mOhm; Voltage Rating (DC): 150V; Temperature Coefficient: 200ppm/degreesC; Height: 0.5mm; Depth: 1.25mm; Case Code (Imperial): 0805; Lead Free: LeadFree; Military Standard: Not; Package Description: 2-Pin Surface Mounted Device, Body 2 x 1.25 mm; Case Code (Metric): 2012; Composition: ThickFilm; Voltage Rating: 150V; Manufacturer URL: http://www.yageo.com/; Packaging: TapeandReel; Package Reference: 0805; REACH SVHC: Unknown; Tolerance: 5%; Case/Package: 0805; Max Operating Temperature: 155degC; Number of Pins: 2; Min Operating Temperature: -55degC; RoHSCompliant: true; Length: 2mm; Datasheet URL: http://www.yageo.com/NewPortal/yageodocoutput?fileName=/pdf/R-Chip/PYu-RC_Group_51_RoHS_L_5.pdf; Termination: SMD/SMT; Radiation Hardening: No; Width: 1.25mm; Contact Plating: Tin; Datasheet Version: Rev. 5, 10/2016
R?#14 = CMP-2001-03615-2: RES Thick Film, 1.5kΩ, 1%, 0.125W, 100ppm/°C, 0805; Resistance: 1.5kR; Power Rating: 125mW; Voltage Rating: 150V; Features: Automotive AEC-Q200; Length: 2mm; Min Operating Temperature: -55°C; Width: 0.049inch; Tolerance: 1%; Temperature Coefficient: 100ppm/°C; Case Code (Imperial): 0805; Case Code (Metric): 2012; Package Quantity: 10; Number of Terminations: 2; Max Operating Temperature: 155°C; Military Standard: Not; Height: 0.45mm; Depth: 1.25mm; Lead Free: Lead Free; Packaging: Tape and Reel; Weight: 0.000194oz; Voltage Rating (DC): 150V; Composition: Thick Film; Radiation Hardening: No; Case/Package: 0805; Termination: SMD/SMT; Contact Plating: Tin; Max Power Dissipation: 125mW
R?#17 R?#21 R?#30 R?#32 = CMP-03211-000756-1: SMD Chip Resistor, Thin Film, 100Ω, 100 V, 0805 [2012 Metric], 100 mW, 0.1%, RN73 Series; Manufacturer: TE Connectivity; Voltage Rating: 100V; Temperature Coefficient: 10ppm/°C; Power Rating: 0.1W; Temperature Range Low: -55°C; Ipc Land Pattern Name: RESC200125X55; Series: RN73; ComponentLink2URL: https://www.te.com/commerce/DocumentDelivery/DDEController?Action=showdoc&DocId=Data+Sheet%7F1773270%7FP%7Fpdf%7FEnglish%7FENG_DS_1773270_P.pdf%7F1676162-2; Composition: Thin Film; Value: 100Ω; Device Class L1: Passive Components; Device Class L3: Chip SMD Resistors; Lead Free: Yes; Octopart: https://octopart.com/rn73c2a100rbtdf-te+connectivity-41188433; Temperature: -55°C to 155°C; packaging: 1000 Reel; Tolerance: 0.1%; Height: 0.65mm; Manufacturer Part Number: RN73C2A100RBTDF; Automotive: No; Temperature Range High: 155°C; Resistance: 100Ω; RoHS: TRUE; Category: Res; octopart_url: https://octopart.com/rn73c2a100rbtdf-te+connectivity-41188433; Package: RN732A; ComponentLink2Description: Datasheet; Device Class L2: Resistors
R?#19 R?#25 = CMP-1013-00378-3: RES Thick Film, 68Ω, 1%, 0.125W, 100ppm/°C, 0805; Voltage Rating (DC): 150V; Power Rating: 125mW; Resistance: 68R; Case Code (Metric): 2012; Height: 0.45mm; Depth: 1.25mm; Length: 2mm; Max Power Dissipation: 125mW; Termination: SMD/SMT; Packaging: Tape and Reel; Military Standard: Not; Width: 0.049inch; Radiation Hardening: No; Tolerance: 1%; Package Quantity: 5000; Voltage Rating: 150V; Temperature Coefficient: 100ppm/°C; Number of Terminations: 2; Case Code (Imperial): 0805; Weight: 0.000194oz; Min Operating Temperature: -55°C; Mount: Surface Mount; Case/Package: 0805; Features: Automotive AEC-Q200; Max Operating Temperature: 155°C; Lead Free: Lead Free; Composition: Thick Film; Contact Plating: Tin
R?#22 R?#23 = CMP-2100-03670-1: Chip Resistor, 10 Ohm, +/- 1%, 0.125 W, -55 to 155 degC, 0805 (2012 Metric), RoHS, Tape and Reel; Manufacturer: Yageo; Resistance: 10Ohm; Power Rating: 125mW; Voltage Rating: 150V; Temperature Coefficient: 200ppm/degreesC; Number of Pins: 2; REACH SVHC: NoSVHC; Datasheet Version: Rev. 5, 10/2016; Max Operating Temperature: 155degC; Manufacturer URL: http://www.yageo.com/; Case Code (Imperial): 0805; Package Description: 2-Pin Surface Mounted Device, Body 2 x 1.25 mm; Case Code (Metric): 2012; Length: 2mm; RoHSCompliant: true; Max Power Dissipation: 125mW; Depth: 1.25mm; Packaging: TapeandReel; Height: 0.5mm; Package Reference: 0805; Package Quantity: 1; Tolerance: 1%; Termination: SMD/SMT; Min Operating Temperature: -55degC; Lead Free: LeadFree; Width: 1.25mm; Voltage Rating (DC): 150V; Datasheet URL: http://www.yageo.com/NewPortal/yageodocoutput?fileName=/pdf/R-Chip/PYu-RC_Group_51_RoHS_L_5.pdf; Composition: ThickFilm; Number of Terminations: 2; Case/Package: 0805
R?#24 = CMP-2100-03671-1: Chip Resistor, 1 KOhm, +/- 1%, 125 mW, -55 to 155 degC, 0805 (2012 Metric), RoHS, Tape and Reel; Manufacturer: Yageo; Temperature Coefficient: 100ppm/degreesC; Voltage Rating (DC): 150V; Max Power Dissipation: 125mW; Resistance: 1KOhm; Number of Pins: 2; Number of Terminations: 2; Datasheet URL: http://www.yageo.com/NewPortal/yageodocoutput?fileName=/pdf/R-Chip/PYu-RC_Group_51_RoHS_L_5.pdf; Length: 0.079inch; Package Description: 2-Pin Surface Mounted Device, Body 2 x 1.25 mm; Depth: 1.25mm; Height: 0.024inch; Military Standard: Not; Case/Package: 0805; Package Reference: 0805; RoHSCompliant: true; Lead Free: LeadFree; Packaging: TapeandReel; Package Quantity: 1; Datasheet Version: Rev. 5, 10/2016; Tolerance: 1%; Min Operating Temperature: -55degC; Voltage Rating: 150V; Composition: ThickFilm; Case Code (Imperial): 0805; Power Rating: 125mW; Width: 0.049inch; Case Code (Metric): 2012; Manufacturer URL: http://www.yageo.com/; Max Operating Temperature: 155degC; REACH SVHC: Unknown; Termination: SMD/SMT
R?#26 = CMP-2001-04934-2: RES Thick Film, 12kΩ, 1%, 0.125W, 100ppm/°C, 0805; Power Rating: 125mW; Voltage Rating (DC): 150V; Resistance: 12kR; Height: 0.45mm; Temperature Coefficient: 100ppm/°C; Min Operating Temperature: -55°C; Case/Package: 0805; Case Code (Imperial): 0805; Contact Plating: Tin; Tolerance: 1%; Weight: 0.000194oz; Max Operating Temperature: 155°C; Features: Automotive AEC-Q200; Mount: Surface Mount; Composition: Thick Film; Max Power Dissipation: 125mW; Number of Terminations: 2; Military Standard: Not; Package Quantity: 10; Width: 0.049inch; Lead Free: Lead Free; Length: 2mm; Depth: 1.25mm; Packaging: Tape and Reel; Radiation Hardening: No; Case Code (Metric): 2012; Voltage Rating: 150V; Termination: SMD/SMT
R?#29 = CMP-2001-01361-1: Manufacturer: Yageo; Part Number: RC0805JR-072KL
SW?#1 SW?#2 = CMP-2000-06884-2: SWITCH SLIDE SPDT 300MA 6V; Actuator Material: Nylon; Switch Function: On-On; Insulation Resistance: 100mR; Actuator Type: Standard; Mechanical Life: 10000Cycles; Actuator Length: 1.5mm; Contact Resistance: 70mR; Min Operating Temperature: -20°C; Max Current Rating: 300mA; Max Voltage Rating (DC): 6V; Package Quantity: 1; Mount: Surface Mount; Packaging: Tape and Reel; Contact Plating: Silver; Depth: 5mm; REACH SVHC: No SVHC; Voltage Rating (DC): 6V; Voltage Rating (AC): 6V; Max Operating Temperature: 85°C; Length: 7.7mm; Termination: Gull Wing; Current Rating: 300mA; Contact Current Rating: 300mA; Orientation: Right Angle; Width: 6.7mm; Switch Travel: 1.5mm; Lead Free: Lead Free; Contact Material: Copper Alloy; Throw Configuration: SPDT
SW?#3-SW?#6 = CMP-2000-05160-2: SWITCH TACTILE SPST-NO 0.05A 12V; Contact Resistance: 100mR; Throw Configuration: SPST; Illumination Type: Non-Illuminated; Mechanical Life: 100000Cycles; Current Rating: 50mA; Switch Function: Off-Mom; Actuator Length: 0.85mm; Actuator Material: Nylon; Actuator Type: Standard; Operating Force: 160gf; Min Operating Temperature: -20°C; REACH SVHC: No SVHC; Termination: Gull Wing; Case/Package: SMD/SMT; Packaging: Tape and Reel; Mount: Surface Mount; Voltage Rating (DC): 12V; Orientation: Straight; Lead Free: Lead Free; Contact Material: Silver; Color: Black; Max Current Rating: 50mA; Contact Plating: Silver; Depth: 9mm; Package Quantity: 1; Max Voltage Rating (DC): 12V; Length: 6mm; Max Operating Temperature: 60°C
U?#1 = CMP-01539-55433846-1: TSRN 1-2433SM Non Isolated Board Mount Dc/dc Converter, Surface Mount Dip, 5.5 W, 1.5 V, 5.5 V, 1 A, 4.6 V Rohs Compliant: Yes; Max Output Current: 1A; Number of Outputs: 1; Min Output Voltage: 1.5V; Max Input Voltage: 42V; Output Power: 5.5W; Min Input Voltage: 4.6V; Output Voltage: 3.3V; Efficiency: 80%; Isolation: Non-Isolated; Max Output Voltage: 5.5V; Width: 9.3mm; Depth: 15.2mm; Output Current: 1A; Length: 15.2mm; Min Operating Temperature: -40°C; Case/Package: SMD/SMT; Number of Pins: 6; Max Input Voltage (DC): 42V; RoHS: Compliant; Max Output Power: 5.5W; NexarPartId: 55433846; Max Operating Temperature: 85°C; Min Input Voltage (DC): 4.6V; Mount: Surface Mount; REACH SVHC: No SVHC; Height: 7mm; Weight: 1.7kg
U?#2 = CMP-04892-000058-1: IC SWITCH DUAL SPDT 10MSOP; On-State Resistance: 10R; Min Supply Voltage: 1.8V; Max Supply Voltage: 5.5V; Turn-On Delay Time: 5.7ns; Number of Inputs: 2; Operating Supply Current: 1uA; Supply Type: Single; High Level Output Current: 50mA; Turn-Off Delay Time: 3.8ns; Number of Outputs: 4; Bandwidth: 220MHz; Polarity: Non-Inverting; Height: 1.02mm; Contact Plating: Gold; Number of Pins: 10; Length: 3mm; Series: -; Packaging: Tape and Reel; Case/Package: VSSOP; Radiation Hardening: No; Width: 3mm; Number of Channels: 2; Max Operating Temperature: 85°C; Lead Free: Lead Free; Weight: 0.000663oz; Package Quantity: 1; Number of Bits: 2; Low Level Output Current: 50mA; Max Supply Current: 1uA; Throw Configuration: SPDT; Min Operating Temperature: -40°C; Mount: Surface Mount
U?#3 = CMP-0339-00043-2: Dual In / Single Out Autoswitching Power Mux, 2.8 to 5.5 V, -40 to 85 degC, 8-pin TSSOP (PW), Green (RoHS & no Sb/Br); Manufacturer: Texas Instruments; IN2 Output Current(Max)(A): 1.25; SubFamily: Power Multiplexer (MUX); IN2 rDS(on)(Typ)(Ohms): 0.084; IN1, IN2 Input Voltage(Min)(V): 2.8; IN1 rDS(on)(Typ)(mOhm): 84; IN1, IN2 Input Voltage(Max)(V): 5.5; Number of Inputs: 2; Mounting Technology: Surface Mount; Code_JEDEC: MO-153; IN1 Output Current(Max)(A): 1.25; DatasheetVersion: SBVS045C; ComponentLink1Description: Datasheet; PackageVersion: revG, Feb-2011; Eco-Plan: Green (RoHS & no Sb/Br); ComponentLink1URL: http://www.ti.com/general/docs/lit/getliterature.tsp?genericPartNumber=TPS2113A&fileType=pdf; PackageDescription: 8-Pin Plastic Thin Small Outline Package 3 x 4.4 mm Body ,0.65 mm Pitch; PackageReference: PW0008A; PartNumber: TPS2113APW
U?#4 = CMP-0326-00046-3: ESD Solution for Super-Speed (6 Gbps) USB 3.0 Interface, 2 Channels, -40 to +85 degC, 3-pin SOT (DRT), Green (Rohs & No Sb/Br); Manufacturer: Texas Instruments; Differential Capacitance(pF): 0.01; Breakdown Voltage(Min)(V): 9; HDMI: TRUE; IEC 61000-4-2 Air-Gap(+/- kV): 8; IO Leakage Current(nA): 10; IO Capacitance(Typ)(pF): 0.7; Mounting Technology: Surface Mount; PackageDescription: 3-Flat Lead Plastic Small Outline, 1 x 1 mm (inc leads), 0.35 mm Pitch; IEC 61000-4-2 Contact(+/- kV): 8; USB Super Speed: TRUE; Eco-Plan: Green (RoHS & no Sb/Br); USB High Speed: TRUE; PackageReference: DRT0003A; SubFamily: ESD Solution; USB Full Speed: TRUE; ComponentLink1Description: Datasheet; ComponentLink2URL: SamplesURL:http://www.ti.com/product/tpd2eusb30#samples; PackageVersion: revD, Jun-2008; ComponentLink2Description: URL Link1; 1394 / Firewire: TRUE; PartNumber: TPD2EUSB30DRTR; ComponentLink1URL: http://www.ti.com/general/docs/lit/getliterature.tsp?genericPartNumber=TPD2EUSB30&fileType=pdf; DatasheetVersion: SLVSAC2C; Serial ATA / eSATA: TRUE
U?#5 = CMP-0078-00023-3: Dual High Speed USB To Multipurpose UART/FIFO IC, 64-pin LQFP, Tape and Reel; Manufacturer: FTDI; DatasheetVersion: ver 2.21, Jun-2012; ComponentLink1URL: http://www.ftdichip.com/; PartNumber: FT2232HL-Reel; ComponentLink2Description: Datasheet; RevisionNote: DatasheetVersion updated to 2.21 Jun-2012; PackageVersion: Jun-12; ComponentLink1Description: Manufacturer URL; ComponentLink2URL: http://www.ftdichip.com/Support/Documents/DataSheets/ICs/DS_FT2232H.pdf; PackageReference: LQFP-64; PackageDescription: 64-Pin Thin Quad Flat Pack, 10 x 10 x 1.4 mm Body, 0.5 mm Pitch
U?#6 = CMP-1615-00149-4: IC INVERTER SCHMITT 6CH 14SOIC; Manufacturer: TEXAS INSTRUMENTS; Number Of Inputs: 1; Number Of Circuits: 6; Standoff Height: 0.1mm; Max Supply Voltage: 3.6V; Min Supply Voltage: 1.65V; Logic Function Desc: Inverting; Propagation Delay: 3.2ns; Nominal Supply Current: 1uA; Device Class L1: Integrated Circuits (ICs); Package: D0014A; Device Class L3: Logic Gates; Manufacturer Part Number: SN74LVC14AD; RoHS: TRUE; Digikey Description: IC INVERTER SCHMITT 6CH 14SOIC; Octopart: https://octopart.com/sn74lvc14ad-texas+instruments-22854; Number Of Outputs: 1; Temperature Range High: +125°C; ComponentLink2Description: Datasheet; Category: IC; Height: 1.75mm; Automotive: No; Mouser Description: In a Pack of 10, Texas Instruments SN74LVC14AD, Hex Schmitt Trigger CMOS Inverter, 14-Pin SOIC; Temperature Range Low: -40°C; Device Class L2: Logic ICs; Lead Free: Yes; Temperature: -40°C to +125°C; ComponentLink2URL: https://www.ti.com/lit/gpn/SN74LVC14A
U?#7 = CMP-0162-00356-2: IC EEPROM 2K SPI 2MHZ SOT23-6; Access Time: 250ns; Density: 2Kb; Max Supply Voltage: 5.5V; Interface: Serial; Min Supply Voltage: 2.5V; Nominal Supply Current: 2mA; Number of Pins: 6; Radiation Hardening: No; Length: 3.1mm; Height: 1.3mm; Min Operating Temperature: -40°C; Max Operating Temperature: 85°C; Lead Free: Lead Free; Memory Type: EEPROM; Contact Plating: Tin; REACH SVHC: No SVHC; Package Quantity: 3000; Frequency: 2MHz; Width: 1.8mm; Max Frequency: 2MHz; Case/Package: SOT-23; Mount: Surface Mount; Packaging: Tape and Reel; Memory Size: 2Kb
Y? = ABLS2-12.000MHZ-B4Y-T: Crystal or Oscillator; Manufacturer_Name: ABRACON; Datasheet Link: https://abracon.com/Resonators/abls.pdf; Manufacturer_Part_Number: ABLS2-12.000MHZ-B4Y-T; Mouser Part Number: 815-ABLS2-12-B4YT; Mouser Price/Stock: https://www.mouser.co.uk/ProductDetail/ABRACON/ABLS2-12000MHZ-B4Y-T?qs=DZ%2FvJMgWWIs6Scm%252BixQ6gw%3D%3D